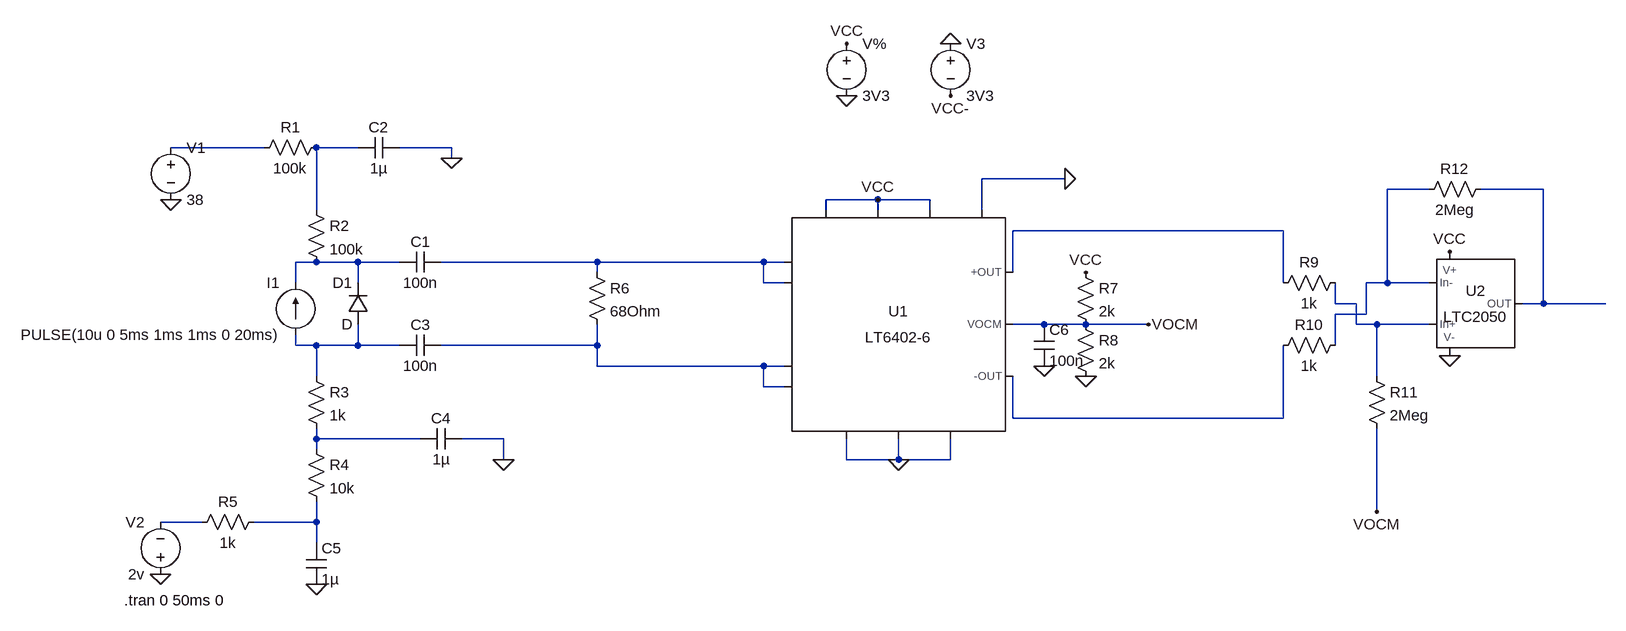
[diagram p0: schematic SIPM_AMP_SIM.asc]
SIPM_AMP_SIM.asc, the LTspice schematic file:
Version 4.1
SHEET 1 2324 760
WIRE 256 48 112 48
WIRE 400 48 336 48
WIRE 544 48 464 48
WIRE 544 64 544 48
WIRE 1488 96 1360 96
WIRE 2048 112 1984 112
WIRE 2224 112 2128 112
WIRE 1200 128 1120 128
WIRE 1280 128 1200 128
WIRE 336 144 336 48
WIRE 1120 144 1120 128
WIRE 1200 144 1200 128
WIRE 1280 144 1280 128
WIRE 1360 144 1360 96
WIRE 1824 176 1408 176
WIRE 336 224 304 224
WIRE 400 224 336 224
WIRE 464 224 400 224
WIRE 768 224 528 224
WIRE 1024 224 768 224
WIRE 1056 224 1024 224
WIRE 768 240 768 224
WIRE 1408 240 1408 176
WIRE 304 256 304 224
WIRE 400 256 400 224
WIRE 1024 256 1024 224
WIRE 1056 256 1024 256
WIRE 1824 256 1824 176
WIRE 1984 256 1984 112
WIRE 1984 256 1952 256
WIRE 2048 256 1984 256
WIRE 1904 288 1904 256
WIRE 1936 288 1904 288
WIRE 2224 288 2224 112
WIRE 2224 288 2192 288
WIRE 2320 288 2224 288
WIRE 1952 304 1952 256
WIRE 1952 304 1904 304
WIRE 1456 320 1408 320
WIRE 1520 320 1456 320
WIRE 1616 320 1520 320
WIRE 1936 320 1936 288
WIRE 1968 320 1936 320
WIRE 2048 320 1968 320
WIRE 304 352 304 336
WIRE 336 352 304 352
WIRE 400 352 400 320
WIRE 400 352 336 352
WIRE 464 352 400 352
WIRE 768 352 768 320
WIRE 768 352 528 352
WIRE 1904 352 1904 304
WIRE 768 384 768 352
WIRE 1024 384 768 384
WIRE 1056 384 1024 384
WIRE 336 400 336 352
WIRE 1968 400 1968 320
WIRE 1024 416 1024 384
WIRE 1056 416 1024 416
WIRE 1408 464 1408 400
WIRE 1824 464 1824 352
WIRE 1824 464 1408 464
WIRE 336 496 336 480
WIRE 496 496 336 496
WIRE 624 496 560 496
WIRE 336 512 336 496
WIRE 624 528 624 496
WIRE 1152 528 1152 496
WIRE 1232 528 1232 496
WIRE 1232 528 1152 528
WIRE 1312 528 1312 496
WIRE 1312 528 1232 528
WIRE 1968 608 1968 480
WIRE 160 624 96 624
WIRE 336 624 336 592
WIRE 336 624 240 624
WIRE 336 656 336 624
FLAG 544 64 0
FLAG 624 528 0
FLAG 336 720 0
FLAG 96 704 0
FLAG 112 128 0
FLAG 1152 -32 0
FLAG 1152 -112 VCC
FLAG 1312 -112 0
FLAG 1312 -32 VCC-
FLAG 1232 528 0
FLAG 1200 128 VCC
FLAG 1488 96 0
FLAG 1520 240 VCC
FLAG 1520 400 0
FLAG 1456 384 0
FLAG 1616 320 VOCM
FLAG 2080 208 VCC
FLAG 2080 368 0
FLAG 1968 608 VOCM
SYMBOL voltage 112 32 R0
SYMATTR InstName V1
SYMATTR Value 38
SYMBOL res 352 32 R90
WINDOW 0 0 56 VBottom 2
WINDOW 3 32 56 VTop 2
SYMATTR InstName R1
SYMATTR Value 100k
SYMBOL res 320 128 R0
SYMATTR InstName R2
SYMATTR Value 100k
SYMBOL cap 528 208 R90
WINDOW 0 0 32 VBottom 2
WINDOW 3 32 32 VTop 2
SYMATTR InstName C1
SYMATTR Value 100n
SYMBOL cap 464 32 R90
WINDOW 0 0 32 VBottom 2
WINDOW 3 32 32 VTop 2
SYMATTR InstName C2
SYMATTR Value 1µ
SYMBOL cap 528 336 R90
WINDOW 0 0 32 VBottom 2
WINDOW 3 32 32 VTop 2
SYMATTR InstName C3
SYMATTR Value 100n
SYMBOL res 320 384 R0
SYMATTR InstName R3
SYMATTR Value 1k
SYMBOL res 320 496 R0
SYMATTR InstName R4
SYMATTR Value 10k
SYMBOL cap 560 480 R90
WINDOW 0 0 32 VBottom 2
WINDOW 3 32 32 VTop 2
SYMATTR InstName C4
SYMATTR Value 1µ
SYMBOL res 256 608 R90
WINDOW 0 0 56 VBottom 2
WINDOW 3 32 56 VTop 2
SYMATTR InstName R5
SYMATTR Value 1k
SYMBOL cap 320 656 R0
SYMATTR InstName C5
SYMATTR Value 1µ
SYMBOL voltage 96 720 R180
WINDOW 0 24 96 Left 2
WINDOW 3 24 16 Left 2
SYMATTR InstName V2
SYMATTR Value 2v
SYMBOL diode 416 320 R180
WINDOW 0 24 64 Left 2
WINDOW 3 24 0 Left 2
SYMATTR InstName D1
SYMBOL voltage 1152 -128 R0
SYMATTR InstName V%
SYMATTR Value 3V3
SYMBOL voltage 1312 -128 R0
SYMATTR InstName V3
SYMATTR Value 3V3
SYMBOL current 304 336 R180
WINDOW 0 24 80 Left 2
WINDOW 3 24 0 Left 2
WINDOW 123 0 0 Left 0
WINDOW 39 0 0 Left 0
SYMATTR InstName I1
SYMATTR Value PULSE(10u 0 5ms 1ms 1ms 0 20ms)
SYMBOL OpAmps\\LT6402-6 1232 320 R0
SYMATTR InstName U1
SYMBOL res 752 224 R0
SYMATTR InstName R6
SYMATTR Value 68Ohm
SYMBOL res 1504 224 R0
SYMATTR InstName R7
SYMATTR Value 2k
SYMBOL res 1504 304 R0
SYMATTR InstName R8
SYMATTR Value 2k
SYMBOL cap 1440 320 R0
SYMATTR InstName C6
SYMATTR Value 100n
SYMBOL res 1920 240 R90
WINDOW 0 0 56 VBottom 2
WINDOW 3 32 56 VTop 2
SYMATTR InstName R9
SYMATTR Value 1k
SYMBOL res 1920 336 R90
WINDOW 0 0 56 VBottom 2
WINDOW 3 32 56 VTop 2
SYMATTR InstName R10
SYMATTR Value 1k
SYMBOL res 1952 384 R0
SYMATTR InstName R11
SYMATTR Value 2Meg
SYMBOL OpAmps\\LTC2050 2080 288 R0
SYMATTR InstName U2
SYMBOL res 2144 96 R90
WINDOW 0 0 56 VBottom 2
WINDOW 3 32 56 VTop 2
SYMATTR InstName R12
SYMATTR Value 2Meg
TEXT 40 744 Left 2 !.tran 0 50ms 0

The netlist it stands for:
* SIPM_AMP_SIM.asc
V1 N001 0 38
R1 N002 N001 100k
R2 N002 N006 100k
C1 N007 N006 100n
C2 0 N002 1µ
C3 N010 N009 100n
R3 N009 N012 1k
R4 N012 N014 10k
C4 0 N012 1µ
R5 N014 N013 1k
C5 N014 0 1µ
V2 0 N013 2v
D1 N009 N006 D
V% VCC 0 3V3
V3 0 VCC- 3V3
I1 N009 N006 PULSE(10u 0 5ms 1ms 1ms 0 20ms)
X§U1 VCC VOCM VCC 0 N005 NC_01 NC_02 N011 0 VCC 0 0 N007 N007 N010 N010 LT6402-6  ; pins ? VOCM ? ? +OUT +OUTFILT -OUTFILT -OUT ? ? ? ? ? ? ? ?
R6 N007 N010 68Ohm
R7 VCC VOCM 2k
R8 VOCM 0 2k
C6 VOCM 0 100n
R9 N008 N005 1k
R10 N003 N011 1k
R11 N008 VOCM 2Meg
X§U2 N008 N003 VCC 0 N004 NC_03 LTC2050  ; pins In+ In- V+ V- OUT SHDN
R12 N004 N003 2Meg
.model D D
.lib standard.dio
.tran 0 50ms 0
.backanno
.end